# EAGLE design electronicDie (EAGLE 9.6.2)
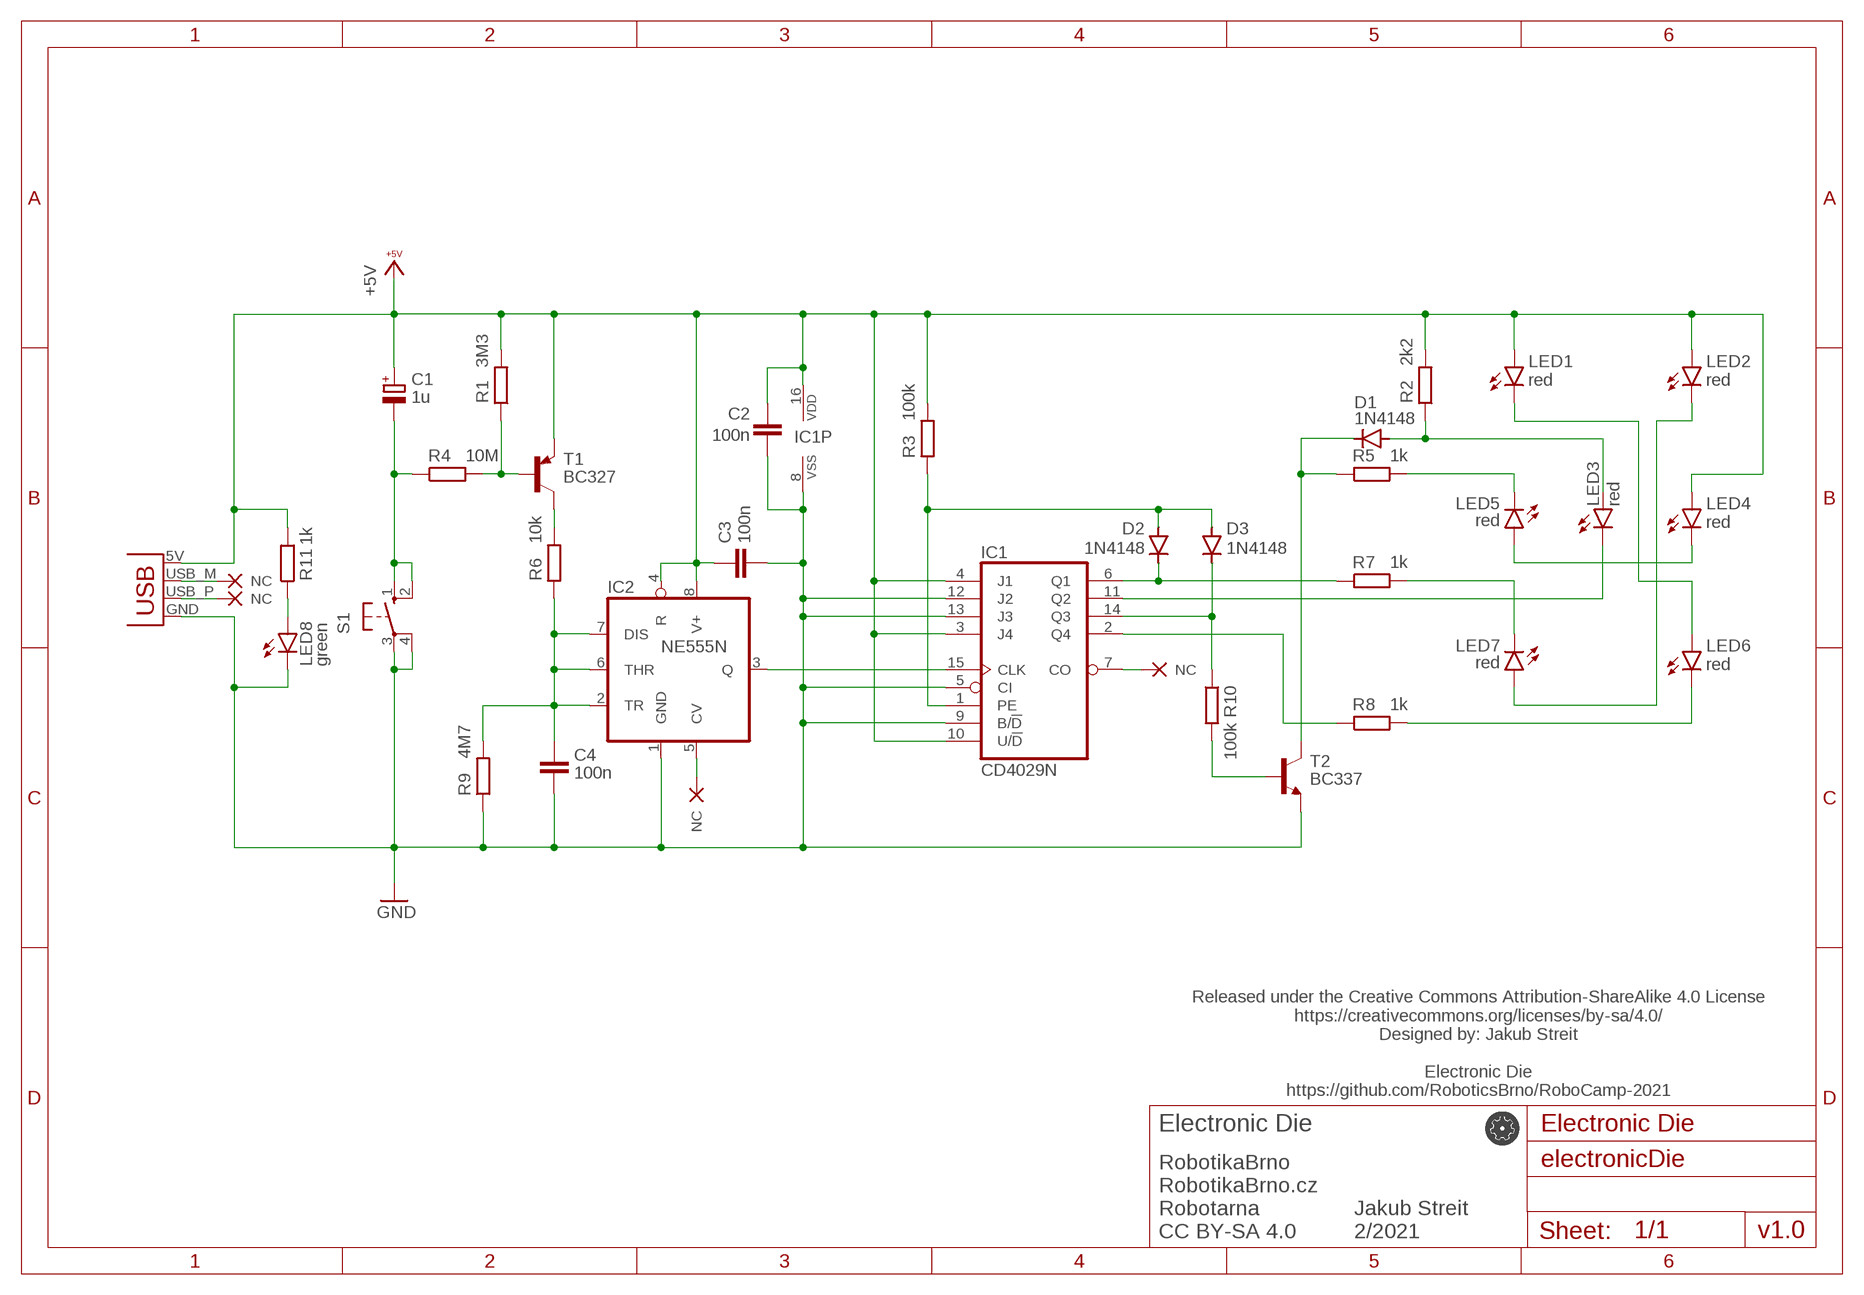
[diagram p0: schematic, sheet 1]

## Parts
C1  1u  CPOL-EUE2-5  [E2-5]
C2  100n  C-EU025-025X050  [C025-025X050]
C3  100n  C-EU025-025X050  [C025-025X050]
C4  100n  C-EU025-025X050  [C025-025X050]
D1  1N4148  1N4148DO35-7  [DO35-7]
D2  1N4148  1N4148DO35-7  [DO35-7]
D3  1N4148  1N4148DO35-7  [DO35-7]
IC1  CD4029N  4029N  [DIL16]
IC2  NE555N  [DIL08]
LED1  red  LED5MM  [LED5MM]
LED2  red  LED5MM  [LED5MM]
LED3  red  LED5MM  [LED5MM]
LED4  red  LED5MM  [LED5MM]
LED5  red  LED5MM  [LED5MM]
LED6  red  LED5MM  [LED5MM]
LED7  red  LED5MM  [LED5MM]
LED8  green  LEDCHIPLED_0603  [CHIPLED_0603]
NC1  NC  (no package)
NC2  NC  (no package)
NC3  NC  (no package)
NC4  NC  (no package)
R1  3M3  R-EU_0204/7  [0204/7]
R2  2k2  R-EU_0204/7  [0204/7]
R3  100k  R-EU_0204/7  [0204/7]
R4  10M  R-EU_0204/7  [0204/7]
R5  1k  R-EU_0204/7  [0204/7]
R6  10k  R-EU_0204/7  [0204/7]
R7  1k  R-EU_0204/7  [0204/7]
R8  1k  R-EU_0204/7  [0204/7]
R9  4M7  R-EU_0204/7  [0204/7]
R10  100k  R-EU_0204/7  [0204/7]
R11  1k  R-EU_R0603  [R0603]
S1  10-XX  [B3F-10XX]
T1  BC327  BC327-16-PNP-TO92-EBC  [TO92-EBC]
T2  BC337  BC337-16-NPN-TO92-CBE  [TO92-CBE]
X1  USBPCB  [USB-A-PCB]

## Nets
+5V: C1.+ C2.1 C3.1 IC1.3(J4) IC1.4(J1) IC1.10(U/!D) IC1.16(VDD) IC2.4(R) IC2.8(V+) LED1.A LED2.A LED4.A R1.2 R2.2 R3.2 R11.2 T1.E X1.5V(VBUS)
GND: C2.2 C3.2 C4.2 IC1.5(CI) IC1.8(VSS) IC1.9(B/!D) IC1.12(J2) IC1.13(J3) IC2.1(GND) LED8.C R9.1 S1.3(P) S1.4(P1) T2.E X1.GND
N$1: C1.- R4.1 S1.1(S) S1.2(S1)
N$2: R1.1 R4.2 T1.B
N$3: LED8.A R11.1
N$4: R6.2 T1.C
N$5: C4.1 IC2.2(TR) IC2.6(THR) IC2.7(DIS) R6.1 R9.2
N$6: IC2.5(CV) NC1.NC
N$7: IC1.15(CLK) IC2.3(Q)
N$8: LED7.K(C) R7.2
N$9: D2.A D3.A IC1.1(PE) R3.1
N$10: D2.C IC1.6(Q1) R7.1
N$11: D3.C IC1.14(Q3) R10.1
N$12: IC1.2(Q4) R8.1
N$13: LED4.K(C) LED5.A
N$14: LED2.K(C) LED7.A
N$15: IC1.7(CO) NC2.NC
N$16: LED1.K(C) LED6.A
N$17: R10.2 T2.B
N$18: LED5.K(C) R5.2
N$19: D1.A LED3.A R2.1
N$20: IC1.11(Q2) LED3.K(C)
N$21: D1.C R5.1 T2.C
N$22: LED6.K(C) R8.2
N$23: NC3.NC X1.USB_M(D-)
N$24: NC4.NC X1.USB_P(D+)

## Notes on the sheet
- Released under the Creative Commons Attribution-ShareAlike 4.0 License
  https://creativecommons.org/licenses/by-sa/4.0/
  Designed by: Jakub Streit
  
  Electronic Die
  https://github.com/RoboticsBrno/RoboCamp-2021
- Electronic Die
- RobotikaBrno
  RobotikaBrno.cz
  Robotarna
  CC BY-SA 4.0
- Jakub Streit
  2/2021
- v1.0

## Library data of the parts
C1 = rcl_upravena:CPOL-EU: POLARIZED CAPACITOR, European symbol
C2-C4 = rcl_upravena:C-EU: CAPACITOR, European symbol
D1-D3 = diode:1N4148: DIODE high speed (Philips)
IC1 = 40xx:4029: Binary/decimal up/down COUNTER
IC2 = 555:*555: TIMER
LED1-LED8 = led:LED: LED
NC1-NC4 = NC:NC: _EXTERNAL_
R1-R11 = rcl_upravena:R-EU_: RESISTOR, European symbol
S1 = switch-omron:10-XX: OMRON SWITCH; MPN: B3F-1000; OC_FARNELL: 176432; OC_NEWARK: 36M3542
T1 = transistor:*-PNP-: PNP Transistror
T2 = transistor:*-NPN-: NPN Transistror BF959 corrected 2008.03.06
X1 = USB:USB: USB Connectors USB-B-PTH is fully proven SKU : PRT-00139 USB-miniB is fully proven SKU : PRT-00587 USB-A-PCB is untested. USB-A-H is throughly reviewed, but untested. Spark Fun Electronics SKU : PRT-00437 USB-B-SMT is throughly reviewed, but untested. Needs silkscreen touching up. USB-A-S has not been used/tested USB-MB-H has not been used/tested

## Board
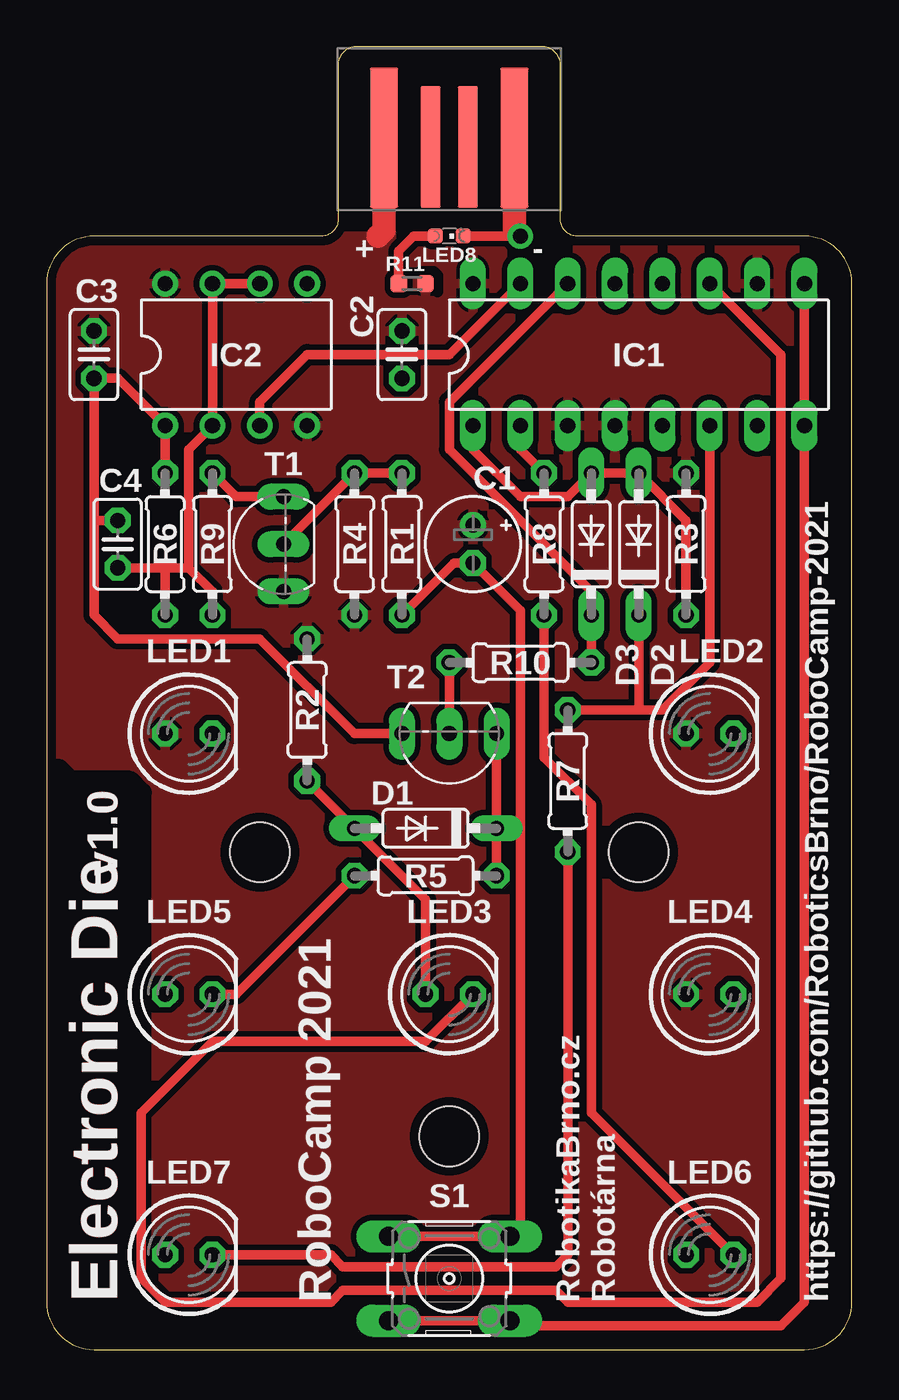
[diagram p1: board, top side]
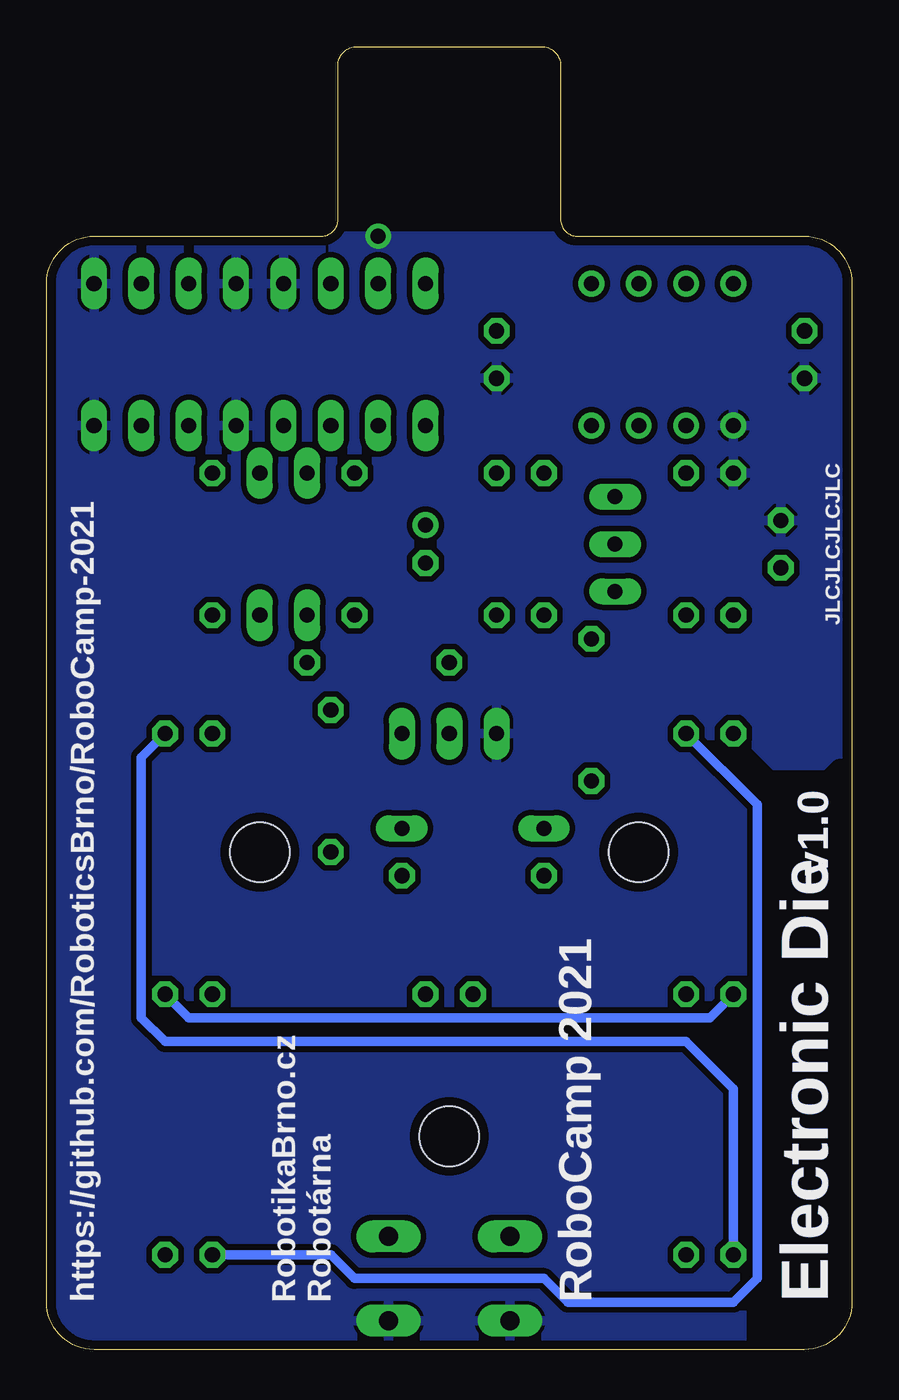
[diagram p2: board, bottom side, seen from below]

Size 43.18 x 69.85 mm. Coordinates in mm from the lower left corner, seen from the top.
Outline: 0,2.54 arc90 2.54,0 40.64,0 arc90 43.18,2.54 43.18,57.15 arc90 40.64,59.69 28.45,59.69 arc-90 27.56,60.58 27.56,68.83 arc90 26.54,69.85 16.64,69.85 arc90 15.62,68.83 15.62,60.58 arc-90 14.73,59.69 2.54,59.69 arc90 0,57.15 0,2.54
Copper layers (1*16): Top 0.035mm / dielectric 2mm / Bottom 0.035mm
Design rules "roboticsbrno": minimum track width 0.15mm, minimum drill 0.3mm, track to track 0.15mm, track to pad 0.15mm, pad to pad 0.15mm, via to via 0.15mm, smd to smd 0.15mm, copper to edge 0.5mm, drill to drill 0.5mm, minimum pad ring 0.16mm, minimum via ring 0.16mm, stop-mask expansion 0.1mm, vias tented up to drill 0.4mm, thermal gap 0.2mm
Holes 3.2 mm at 11.43,26.67 31.75,26.67 21.59,11.43
tRestrict: 7 lines
bRestrict: 4 lines

### Footprints (pad centres in the part's own frame; a part is rotated, then mirrored left to right if it is on the bottom)
E2-5 = drill 0.813 pad 1.27: + -1.016,0 | drill 0.813 pad 1.27 octagon: - 1.016,0
C025-025X050 = drill 0.813 octagon: 1 -1.27,0; 2 1.27,0
DO35-7 = drill 0.813 long: A 3.81,0; C -3.81,0
DIL16 = drill 0.813 long: 1 -8.89,-3.81; 2 -6.35,-3.81; 3 -3.81,-3.81; 4 -1.27,-3.81; 5 1.27,-3.81; 6 3.81,-3.81; 7 6.35,-3.81; 8 8.89,-3.81; 9 8.89,3.81; 10 6.35,3.81; 11 3.81,3.81; 12 1.27,3.81; 13 -1.27,3.81; 14 -3.81,3.81; 15 -6.35,3.81; 16 -8.89,3.81
DIL08 = drill 0.813 pad 1.27: 1 -3.81,-3.81; 2 -1.27,-3.81; 3 1.27,-3.81; 4 3.81,-3.81; 5 3.81,3.81; 6 1.27,3.81; 7 -1.27,3.81; 8 -3.81,3.81
LED5MM = drill 0.813 octagon: A -1.27,0; K 1.27,0
CHIPLED_0603 = smd 0.8 x 0.8: A 0.75,0; C -0.75,0
0204/7 = drill 0.813 octagon: 1 -3.81,0; 2 3.81,0
R0603 = smd 0.89 x 0.93: 1 -0.72,0; 2 0.72,0
B3F-10XX = drill 1.016 long: 1 -3.251,2.261; 2 3.251,2.261; 3 -3.251,-2.261; 4 3.251,-2.261
TO92-EBC = drill 0.813 long: B 0,-1.27; C 2.54,-1.27; E -2.54,-1.27
TO92-CBE = drill 0.813 long: B 0,0; C -2.54,0; E 2.54,0
USB-A-PCB = smd 7.5 x 1.5: 5V -0.2,-3.5; GND -0.2,3.5 | smd 6.5 x 1.067: USB_M 0.3,-1; USB_P 0.3,1

### Placement (x,y rotation side)
C1  22.86,43.18 270 top
C2  19.05,53.34 270 top
C3  2.54,53.34 270 top
C4  3.81,43.18 90 top
D1  20.32,27.94 180 top
D2  31.75,43.18 90 top
D3  29.21,43.18 90 top
IC1  31.75,53.34 0 top
IC2  10.16,53.34 0 top
LED1  7.62,33.02 0 top
LED2  35.56,33.02 0 top
LED3  21.59,19.05 0 top
LED4  35.56,19.05 0 top
LED5  7.62,19.05 0 top
LED6  35.56,5.08 0 top
LED7  7.62,5.08 0 top
LED8  21.59,59.69 180 top
R1  16.51,43.18 270 top
R2  13.97,34.29 90 top
R3  34.29,43.18 90 top
R4  19.05,43.18 90 top
R5  20.32,25.4 180 top
R6  8.89,43.18 90 top
R7  27.94,30.48 270 top
R8  26.67,43.18 270 top
R9  6.35,43.18 270 top
R10  25.4,36.83 180 top
R11  19.6,57.15 0 top
S1  21.59,3.81 0 top
T1  11.43,43.18 90 top
T2  21.59,33.02 180 top
X1  21.59,64.77 270 top

### Tracks (layer width: path | path; a pad name or v marks a point on that pad's centre or on a via)
+5V
  Top 1.27: X1.5V 18.09,60 17.78,59.69
  pour Top (isolate 0.305): 0,0 0,59.69 43.18,59.69 43.18,0
GND  (via drill 0.8)
  Top 0.508: T2.E 16.51,33.02 11.43,38.1 3.81,38.1 2.54,39.37 2.54,44.45 | 2.54,44.45 C3.2 3.81,52.07 IC2.1 R9.1 | C4.2 2.54,44.45 | IC1.9 IC1.8 40.64,2.54 39.37,1.27 25.12,1.27 S1.4 S1.3 | v25.4,59.69 LED8.C
  Top 1.27: X1.GND 25.09,60 v25.4,59.69
  pour Bottom (isolate 0.305): 0,0 0,59.69 43.18,59.69 43.18,0
N$1
  Top 0.508: R4.1 21.84,42.16 C1.- 25.4,39.62 25.4,6.63 S1.2 S1.1
N$2
  Top 0.508: R4.2 R1.1 T1.B
N$3
  Top 0.508: LED8.A 19.68,59.69 18.88,58.88 R11.1
N$4
  Top 0.508: T1.C 10.16,45.72 R6.2
N$5
  Top 0.508: IC2.6 IC2.7 IC2.2 7.62,48.26 7.62,41.91 | 7.62,41.91 6.35,41.91 | 6.35,41.91 C4.1 | R9.2 6.35,41.91 | R6.1 8.89,40.64 7.62,41.91
N$7
  Top 0.508: IC2.3 11.43,50.8 13.97,53.34 21.59,53.34 IC1.15
N$8
  Top 0.508: LED7.K 15.24,5.08 15.88,4.45 27.3,4.45 27.94,5.08 R7.2
N$9
  Top 0.508: IC1.1 22.86,48.26 25.4,45.72 27.94,45.72 D3.A D2.A 34.29,44.45 R3.1
N$10
  Top 0.508: 31.75,34.29 33.02,34.29 35.56,36.83 IC1.6 | 31.75,34.29 R7.1 | D2.C 31.75,34.29
N$11
  Top 0.508: R10.1 D3.C 29.21,40.64 21.59,48.26 21.59,50.8 IC1.14
N$12
  Top 0.508: R8.1 25.4,48.26 IC1.2
N$13
  Bottom 0.508: LED5.A 7.62,17.78 35.56,17.78 LED4.K
N$14
  Bottom 0.508: LED2.K 38.1,31.75 38.1,17.78 36.83,16.51 8.89,16.51 6.35,13.97 LED7.A
N$16
  Bottom 0.508: LED1.K 5.08,29.21 5.08,3.81 6.35,2.54 15.24,2.54 16.51,3.81 26.67,3.81 27.94,5.08 LED6.A
N$17
  Top 0.508: R10.2 T2.B
N$18
  Top 0.508: LED5.K 10.16,19.05 R5.2
N$19
  Top 0.508: R2.1 D1.A 20.32,24.13 LED3.A
N$20
  Top 0.508: IC1.11 39.37,53.34 39.37,3.81 38.1,2.54 27.94,2.54 27.3,3.17 15.88,3.17 15.24,2.54 6.35,2.54 5.08,3.81 5.08,12.7 8.89,16.51 20.32,16.51 LED3.K
N$21
  Top 0.508: R5.1 D1.C T2.C
N$22
  Top 0.508: R8.2 26.67,31.75 29.21,29.21 29.21,12.7 LED6.K

### Text on the board
Top: v1.0 | Electronic Die
Bottom: v1.0 | Electronic Die
tSilk: + | - | v1.0 | Electronic Die | RoboCamp 2021 | RobotikaBrno.cz / Robotárna | https://github.com/RoboticsBrno/RoboCamp-2021
bSilk: JLCJLCJLCJLC | v1.0 | Electronic Die | RoboCamp 2021 | RobotikaBrno.cz / Robotárna | https://github.com/RoboticsBrno/RoboCamp-2021